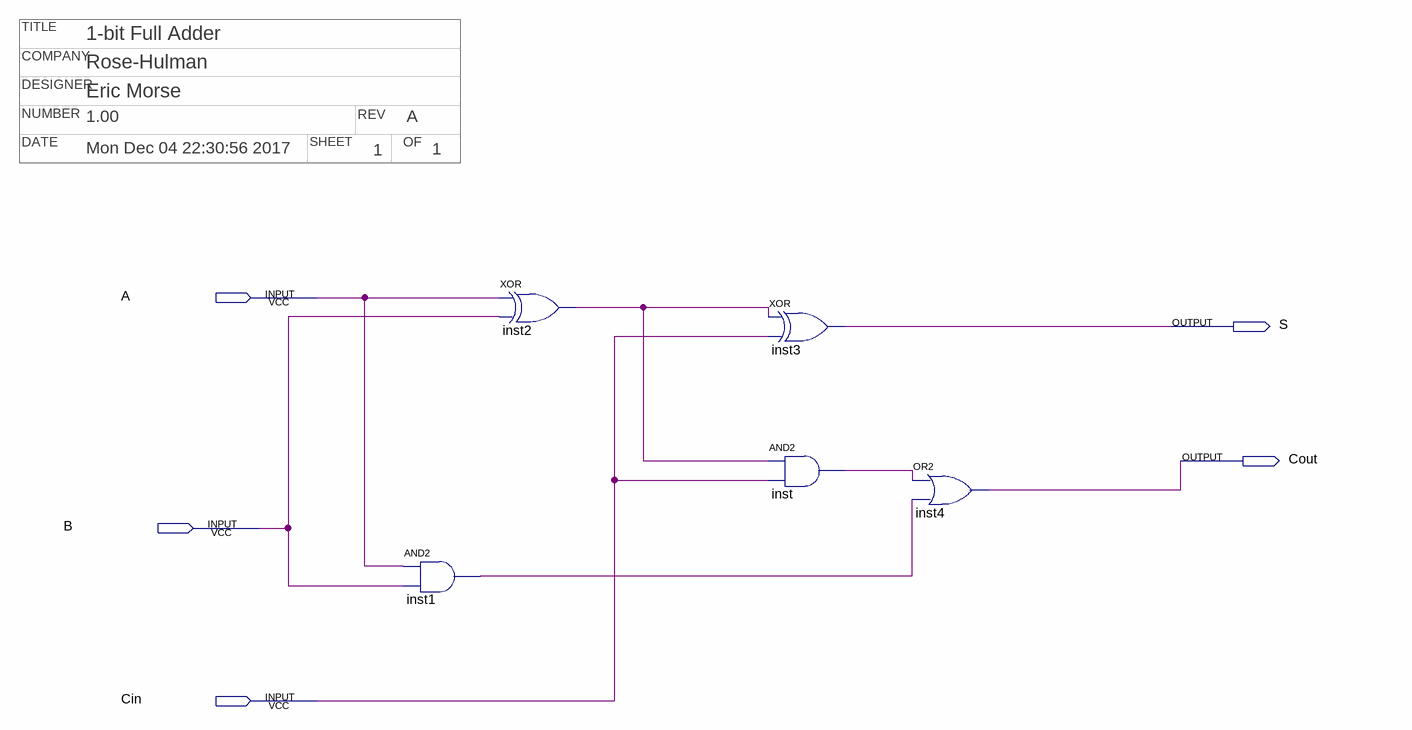
[diagram p0: schematic sheet]
// Quartus schematic fa.bdf as structural Verilog: 5 symbols, 5 pins
// Title block: COMPANY: Rose-Hulman; DATE: Mon Dec 04 22:30:56 2017; DESIGNER: Eric Morse; NUMBER: 1.00; OF: 1; REV: A; SHEET: 1; TITLE: 1-bit Full Adder
module fa (
  input  A,
  input  B,
  input  Cin,
  output S,
  output Cout
);

  wire inst1_out, inst2_out, inst_out;

  and inst1 (inst1_out, A, B);
  xor inst2 (inst2_out, A, B);
  xor inst3 (S, inst2_out, Cin);
  and inst (inst_out, inst2_out, Cin);
  or inst4 (Cout, inst_out, inst1_out);
endmodule
